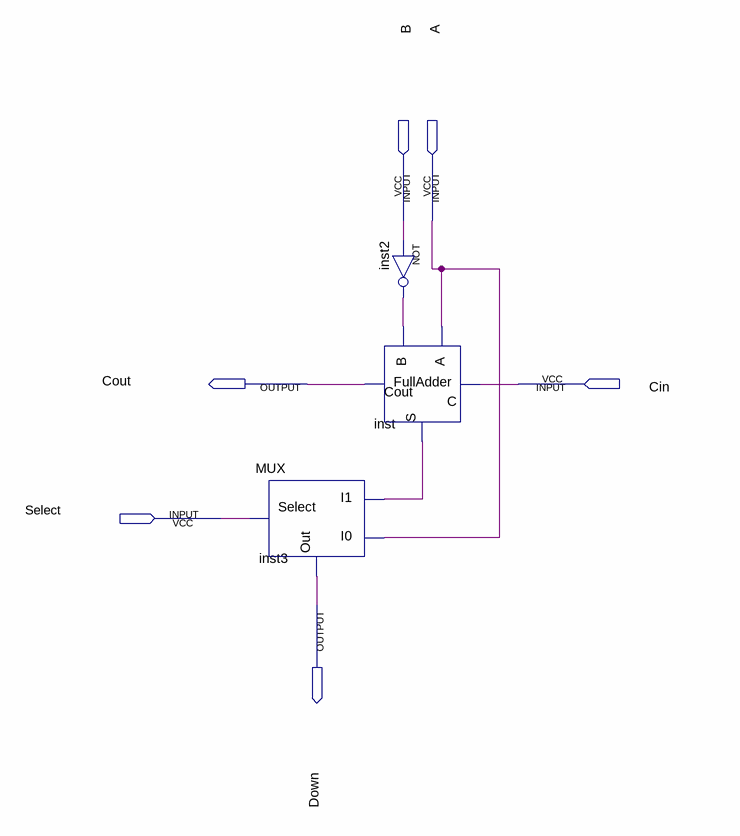
[diagram p0: schematic sheet]
// Quartus schematic PU.bdf as structural Verilog: 3 symbols, 6 pins
module PU (
  input  B,
  input  A,
  input  Cin,
  input  Select,
  output Cout,
  output Down
);

  wire inst2_out, inst_s;

  MUX inst3 (.I0(A), .I1(inst_s), .Select(Select), .Out(Down));
  not inst2 (inst2_out, B);
  FullAdder inst (.A(A), .B(inst2_out), .C(Cin), .S(inst_s), .Cout(Cout));
endmodule
